# EAGLE schematic miditendo_rev3 (EAGLE 6.0)
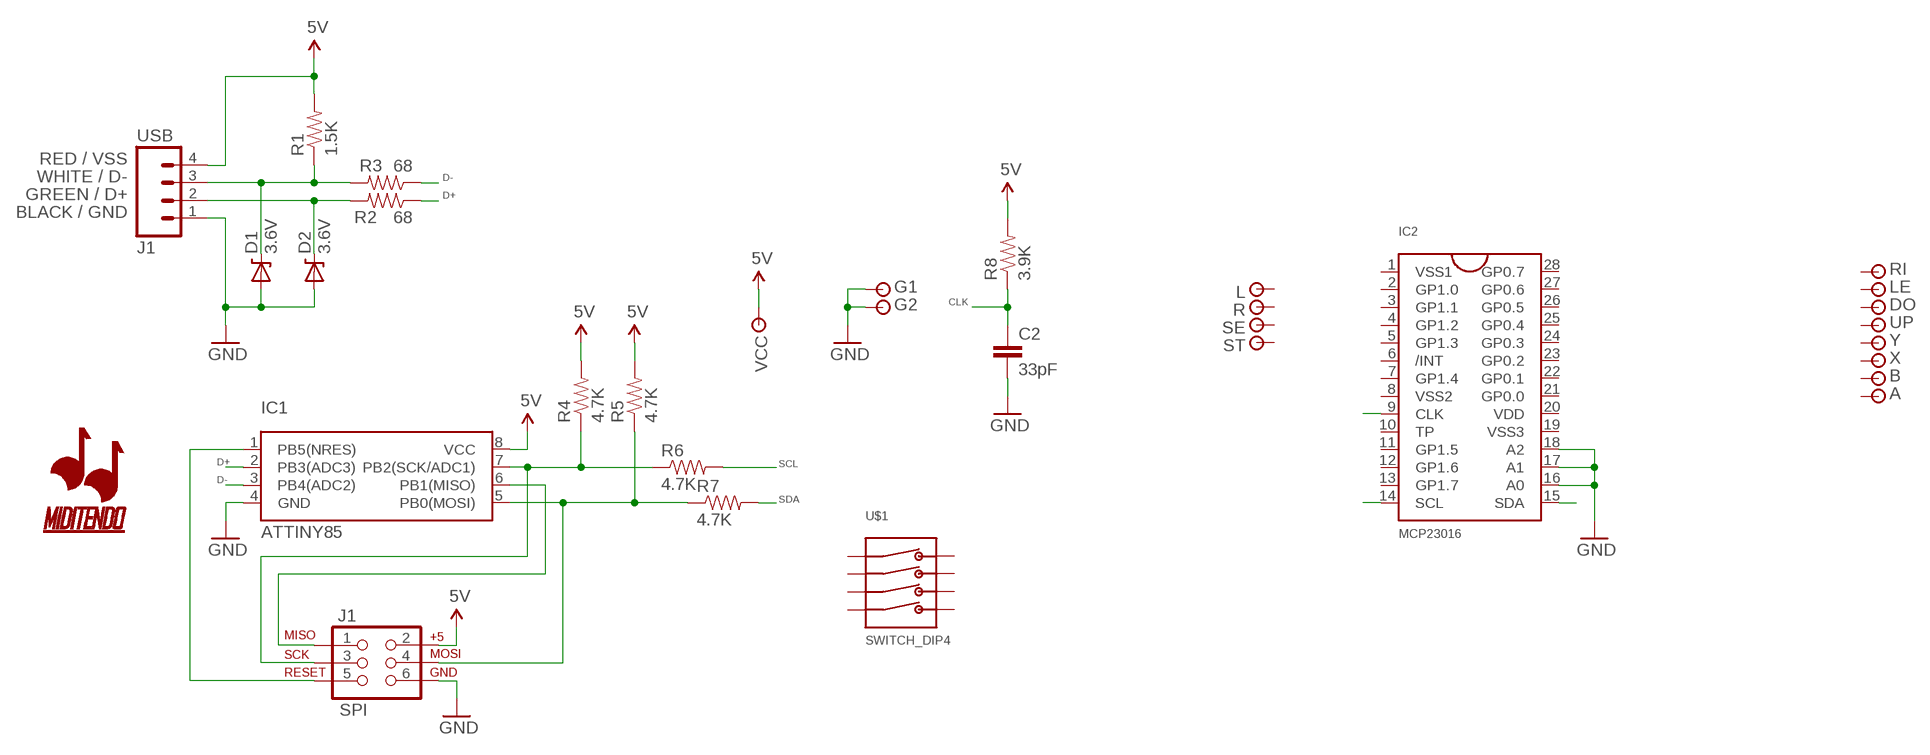
[diagram p0: schematic, sheet 1]

## Parts
A  WIRE_JOINT  [THSOLDERPOINT]
B  WIRE_JOINT  [THSOLDERPOINT]
C2  33pF  CAPACITOR0805  [0805]
D1  3.6V  DIODE-ZENERPTH  [DIODE-ZENER]
D2  3.6V  DIODE-ZENERPTH  [DIODE-ZENER]
DO  WIRE_JOINT  [THSOLDERPOINT]
G1  WIRE_JOINT  [THSOLDERPOINT]
G2  WIRE_JOINT  [THSOLDERPOINT]
IC1  ATTINY85  ATTINY85SOIC  [SOIC8-EIAJ]
IC2  MCP23016  MCP23016SOIC28  [SOIC28]
J1  SPI  AVR_SPI_PRG_6NS  [2X3-NS]
L  WIRE_JOINT  [THSOLDERPOINT]
LE  WIRE_JOINT  [THSOLDERPOINT]
R  WIRE_JOINT  [THSOLDERPOINT]
R1  1.5K  RESISTOR0805  [0805]
R2  68  RESISTOR0805  [0805]
R3  68  RESISTOR0805  [0805]
R4  4.7K  RESISTOR0805  [0805]
R5  4.7K  RESISTOR0805  [0805]
R6  4.7K  RESISTOR0805  [0805]
R7  4.7K  RESISTOR0805  [0805]
R8  3.9K  RESISTOR0805  [0805]
RI  WIRE_JOINT  [THSOLDERPOINT]
SE  WIRE_JOINT  [THSOLDERPOINT]
ST  WIRE_JOINT  [THSOLDERPOINT]
U$1  SWITCH_DIP4  [SWITCH_4DIP]
U$2  MIDITENDO  [MIDITENDO]
UP  WIRE_JOINT  [THSOLDERPOINT]
USB  J1  M04LONGPADS  [1X04_LONGPADS]
VCC  WIRE_JOINT  [THSOLDERPOINT]
X  WIRE_JOINT  [THSOLDERPOINT]
Y  WIRE_JOINT  [THSOLDERPOINT]

## Nets
5V: IC1.8(VCC) J1.2 R1.2 R4.2 R5.2 R8.2 USB.4 VCC.P$1
CLK: C2.1 IC2.9(CLK) R8.1
D+: IC1.2(PB3(ADC3)) R2.1
D-: IC1.3(PB4(ADC2)) R3.1
GND: C2.2 D1.P$2(A) D2.P$2(A) G1.P$1 G2.P$1 IC1.4(GND) IC2.16(A0) IC2.17(A1) IC2.18(A2) J1.6 USB.1
MOSI: IC1.5(PB0(MOSI)) J1.4 R5.1 R7.1
N$5: D1.P$1(C) R1.1 R3.2 USB.3
N$6: IC1.1(PB5(NRES)) J1.5
N$7: D2.P$1(C) R2.2 USB.2
N$8: IC1.6(PB1(MISO)) J1.1
SCK: IC1.7(PB2(SCK/ADC1)) J1.3 R4.1 R6.1
SCL: IC2.14(SCL) R6.2
SDA: IC2.15(SDA) R7.2
Unconnected: A.P$1 B.P$1 DO.P$1 IC2.2(GP1.0) IC2.3(GP1.1) IC2.4(GP1.2) IC2.5(GP1.3) IC2.6(/INT) IC2.7(GP1.4) IC2.10(TP) IC2.11(GP1.5) IC2.12(GP1.6) IC2.13(GP1.7) IC2.21(GP0.0) IC2.22(GP0.1) IC2.23(GP0.2) IC2.24(GP0.3) IC2.25(GP0.4) IC2.26(GP0.5) IC2.27(GP0.6) IC2.28(GP0.7) L.P$1 LE.P$1 R.P$1 RI.P$1 SE.P$1 ST.P$1 U$1.P$1 U$1.P$2 U$1.P$3 U$1.P$4 U$1.P$5 U$1.P$6 U$1.P$7 U$1.P$8 UP.P$1 X.P$1 Y.P$1

## Notes on the sheet
- RED / VSS
- WHITE / D- | D-
- GREEN / D+ | D+
- BLACK / GND
- CLK
- D+ | SCL
- D-
- SDA

## Power pins joined to a net without a drawn wire
VDD: IC2.20(VDD)
VSS1: IC2.1(VSS1)
VSS2: IC2.8(VSS2)
VSS3: IC2.19(VSS3)

## Library data of the parts
A B DO G1 G2 L LE R RI SE ST UP VCC X Y = miditendo:WIRE_JOINT
C2 = miditendo:CAPACITOR
D1 D2 = SparkFun:DIODE-ZENER: Zener Diode Production Part - 8199 3.4V Zener Voltage
IC1 = miditendo:ATTINY85: ATTINY85 The ATtiny85 is a low-power CMOS 8-bit microcontroller based on the AVR enhanced RISC architecture. By executing powerful instructions in a single clock cycle, the ATtiny85 achieves throughputs approaching 1 MIPS per MHz allowing the system designer to optimize power consumption versus processing speed -8K Bytes of In-System Programmable Program Memory Flash -512 Bytes In-System Programmable EEPROM -512 Bytes Internal SRAM
IC2 = miditendo:MCP23016
J1 = SparkFun:AVR_SPI_PRG_6: AVR ISP 6 Pin This is the reduced ISP connector for AVR programming. Common on Arduino. This footprint will take up less PCB space and can be used with a 10-pin to 6-pin adapter such as SKU: BOB-08508
R1-R8 = miditendo:RESISTOR: RESISTOR
U$1 = miditendo:SWITCH_DIP4
U$2 = miditendo:MIDITENDO
USB = SparkFun:M04: Header 4 Standard 4-pin 0.1" header. Use with straight break away headers (SKU : PRT-00116), right angle break away headers (PRT-00553), swiss pins (PRT-00743), machine pins (PRT-00117), and female headers (PRT-00115). Molex polarized connector foot print use with SKU : PRT-08231 with associated crimp pins and housings. 1MM SMD Version SKU: PRT-10208